# Altium schematic sheet R3Change_1.SchDoc
size A4
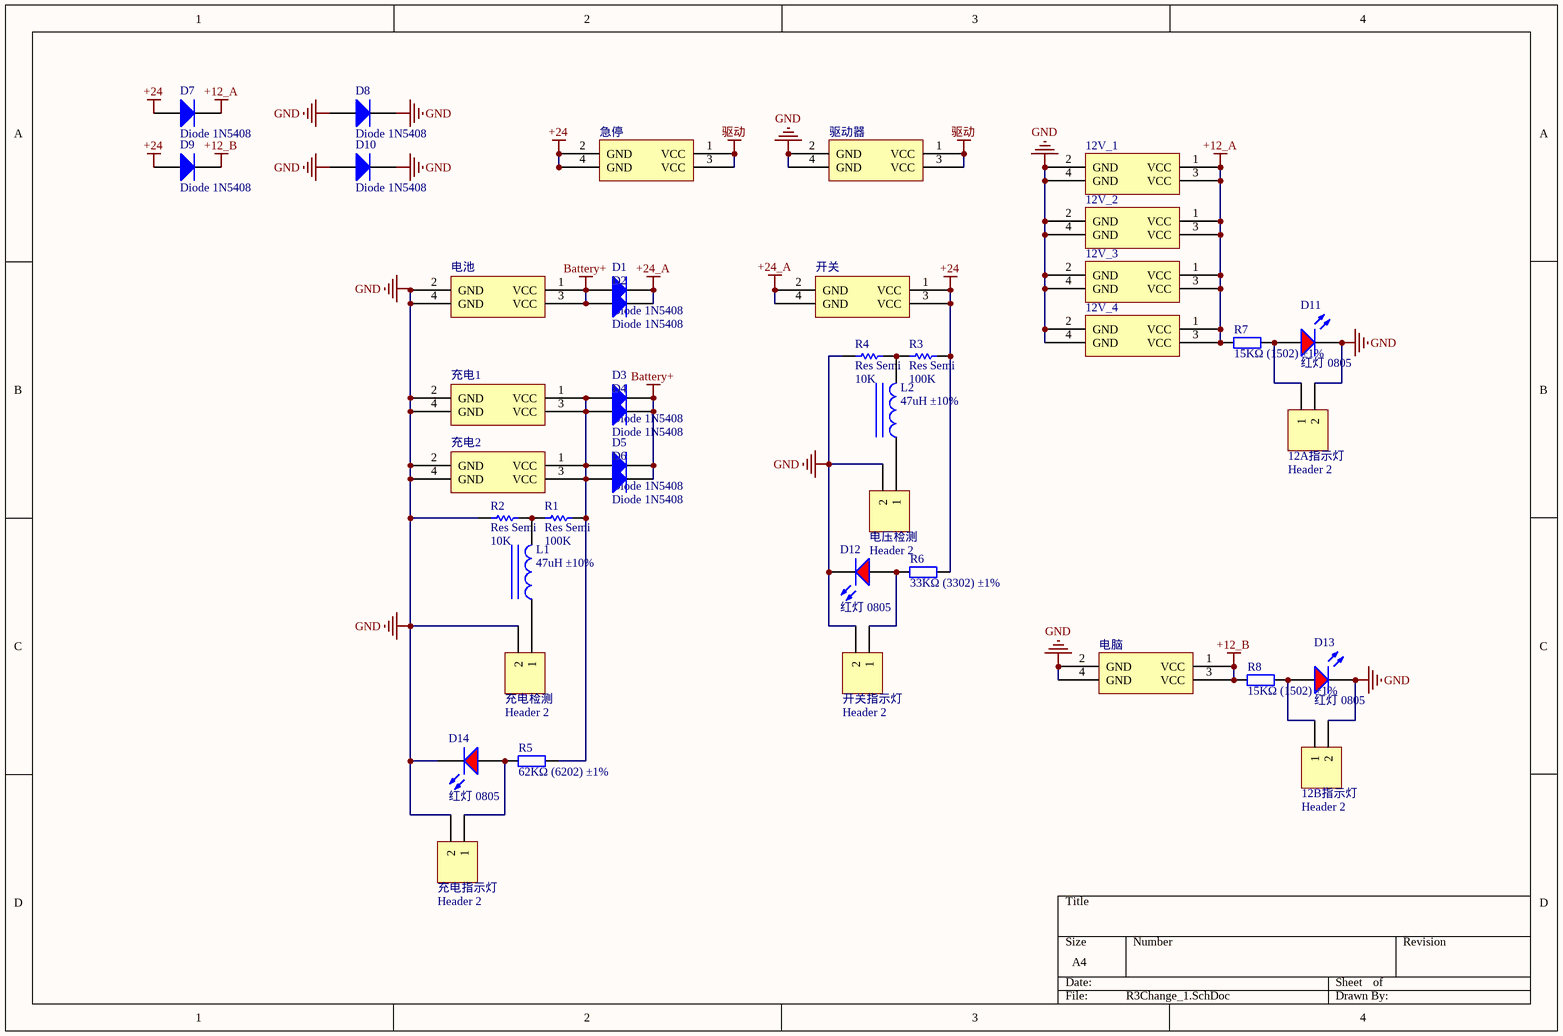
[diagram p0: R3Change_1.SchDoc]

## Parts
12A指示灯  Header 2  [HDR1X2]
12B指示灯  Header 2  [HDR1X2]
12V_1  插座  [HEADER 2X2]  (value not drawn)
12V_2  插座  [HEADER 2X2]  (value not drawn)
12V_3  插座  [HEADER 2X2]  (value not drawn)
12V_4  插座  [HEADER 2X2]  (value not drawn)
D1  Diode 1N5408  [DO-201AD]
D2  Diode 1N5408  [DO-201AD]
D3  Diode 1N5408  [DO-201AD]
D4  Diode 1N5408  [DO-201AD]
D5  Diode 1N5408  [DO-201AD]
D6  Diode 1N5408  [DO-201AD]
D7  Diode 1N5408  [DO-201AD]
D8  Diode 1N5408  [DO-201AD]
D9  Diode 1N5408  [DO-201AD]
D10  Diode 1N5408  [DO-201AD]
D11  红灯 0805  [LC-0805_LED_S1]
D12  红灯 0805  [LC-0805_LED_S1]
D13  红灯 0805  [LC-0805_LED_S1]
D14  红灯 0805  [LC-0805_LED_S1]
L1  47uH ±10%  [LC-0805_L]
L2  47uH ±10%  [LC-0805_L]
R1  Res Semi  value 100K  [AXIAL-0.5]
R2  Res Semi  value 10K  [AXIAL-0.5]
R3  Res Semi  value 100K  [AXIAL-0.5]
R4  Res Semi  value 10K  [AXIAL-0.5]
R5  62KΩ (6202) ±1%  [LC-0805_R]
R6  33KΩ (3302) ±1%  [LC-0805_R]
R7  15KΩ (1502) ±1%  [LC-0805_R]
R8  15KΩ (1502) ±1%  [LC-0805_R]
充电1  插座  [HEADER 2X2]  (value not drawn)
充电2  插座  [HEADER 2X2]  (value not drawn)
充电指示灯  Header 2  [HDR1X2]
充电检测  Header 2  [HDR1X2]
开关  插座  [HEADER 2X2]  (value not drawn)
开关指示灯  Header 2  [HDR1X2]
急停  插座  [HEADER 2X2]  (value not drawn)
电压检测  Header 2  [HDR1X2]
电池  插座  [HEADER 2X2]  (value not drawn)
电脑  插座  [HEADER 2X2]  (value not drawn)
驱动器  插座  [HEADER 2X2]  (value not drawn)

## Nets
+12_A: 12V_1.1(VCC) 12V_1.3(VCC) 12V_2.1(VCC) 12V_2.3(VCC) 12V_3.1(VCC) 12V_3.3(VCC) 12V_4.1(VCC) 12V_4.3(VCC) D7.2(K) R7.1
+12_B: D9.2(K) R8.1 电脑.1(VCC) 电脑.3(VCC)
+24: D7.1(A) D9.1(A) R3.2 R6.2 开关.1(VCC) 开关.3(VCC) 急停.2(GND) 急停.4(GND)
+24_A: D1.2(K) D2.2(K) 开关.2(GND) 开关.4(GND)
Battery+: D1.1(A) D2.1(A) D3.2(K) D4.2(K) D5.2(K) D6.2(K) 电池.1(VCC) 电池.3(VCC)
GND: 12A指示灯.2 12B指示灯.2 12V_1.2(GND) 12V_1.4(GND) 12V_2.2(GND) 12V_2.4(GND) 12V_3.2(GND) 12V_3.4(GND) 12V_4.2(GND) 12V_4.4(GND) D8.1(A) D8.2(K) D10.1(A) D10.2(K) D11.K D12.K D13.K D14.K R2.1 R4.1 充电1.2(GND) 充电1.4(GND) 充电2.2(GND) 充电2.4(GND) 充电指示灯.2 充电检测.2 开关指示灯.2 电压检测.2 电池.2(GND) 电池.4(GND) 电脑.2(GND) 电脑.4(GND) 驱动器.2(GND) 驱动器.4(GND)
驱动: 急停.1(VCC) 急停.3(VCC) 驱动器.1(VCC) 驱动器.3(VCC)
Net12A指示灯_1: 12A指示灯.1 D11.A R7.2
Net12B指示灯_1: 12B指示灯.1 D13.A R8.2
NetD3_1: D3.1(A) D4.1(A) D5.1(A) D6.1(A) R1.2 R5.2 充电1.1(VCC) 充电1.3(VCC) 充电2.1(VCC) 充电2.3(VCC)
NetD12_A: D12.A R6.1 开关指示灯.1
NetD14_A: D14.A R5.1 充电指示灯.1
NetL1_1: L1.1 充电检测.1
NetL1_2: L1.2 R1.1 R2.2
NetL2_1: L2.1 电压检测.1
NetL2_2: L2.2 R3.1 R4.2

## Library data of the parts
12A指示灯 12B指示灯 充电指示灯 充电检测 开关指示灯 电压检测 = Header 2: Header, 2-Pin; LatestRevisionDate: 17-Jul-2002; LatestRevisionNote: Re-released for DXP Platform.; Publisher: Altium Limited
12V_1-12V_4 充电1 充电2 开关 急停 电池 电脑 驱动器 = HEADER_2X2
D1-D10 = Diode 1N5408: 3 Amp Medium Power Silicon Rectifier Diode; Published: 8-Jun-2000; LatestRevisionDate: 17-Jul-2002; LatestRevisionNote: Re-released for DXP Platform.; DatasheetVersion: Aug-1984; PackageReference: DO-201AD; Publisher: Altium Limited; PackageDescription: Diode, Axial; Body 9.5 x 5.3 mm (LxDia. max), Lead Dia. 1.32 mm (max); ComponentLink1Description: Manufacturer Link; ComponentLink1URL: http://www.irf.com/
D11-D14 = 0805 红灯: 发光二极管; ComponentLink1Description: 供应商链接; ComponentLink1URL: http://www.szlcsc.com/product/details_2668.html; Package: 0805; Supplier: LC; SuppliersPartNumber: C2295
L1 L2 = 0805 47uH 10%: 贴片电感; ComponentLink1Description: 供应商链接; ComponentLink1URL: http://www.szlcsc.com/product/details_14964.html; Package: 0805; Supplier: LC; SuppliersPartNumber: C14304
R1-R4 = Res Semi: Semiconductor Resistor; Published: 8-Jun-2000; LatestRevisionDate: 17-Jul-2002; LatestRevisionNote: Re-released for DXP Platform.; PackageReference: AXIAL-0.5; Publisher: Altium Limited; PackageDescription: Axial Device, Thru-Hole; 2 Leads; 0.5 in Pin Spacing
R5 = 0805 62KΩ (6202) 1%: 贴片电阻; ComponentLink1Description: 供应商链接; ComponentLink1URL: http://www.szlcsc.com/product/details_18471.html; Package: 0805; Supplier: LC; SuppliersPartNumber: C17783
R6 = 0805 33KΩ (3302) 1%: 贴片电阻; ComponentLink1Description: 供应商链接; ComponentLink1URL: http://www.szlcsc.com/product/details_18321.html; Package: 0805; Supplier: LC; SuppliersPartNumber: C17633
R7 R8 = 0805 15KΩ (1502) 1%: 贴片电阻; ComponentLink1Description: 供应商链接; ComponentLink1URL: http://www.szlcsc.com/product/details_18163.html; Package: 0805; Supplier: LC; SuppliersPartNumber: C17475